# EAGLE design thermometer (EAGLE 9.6.0)
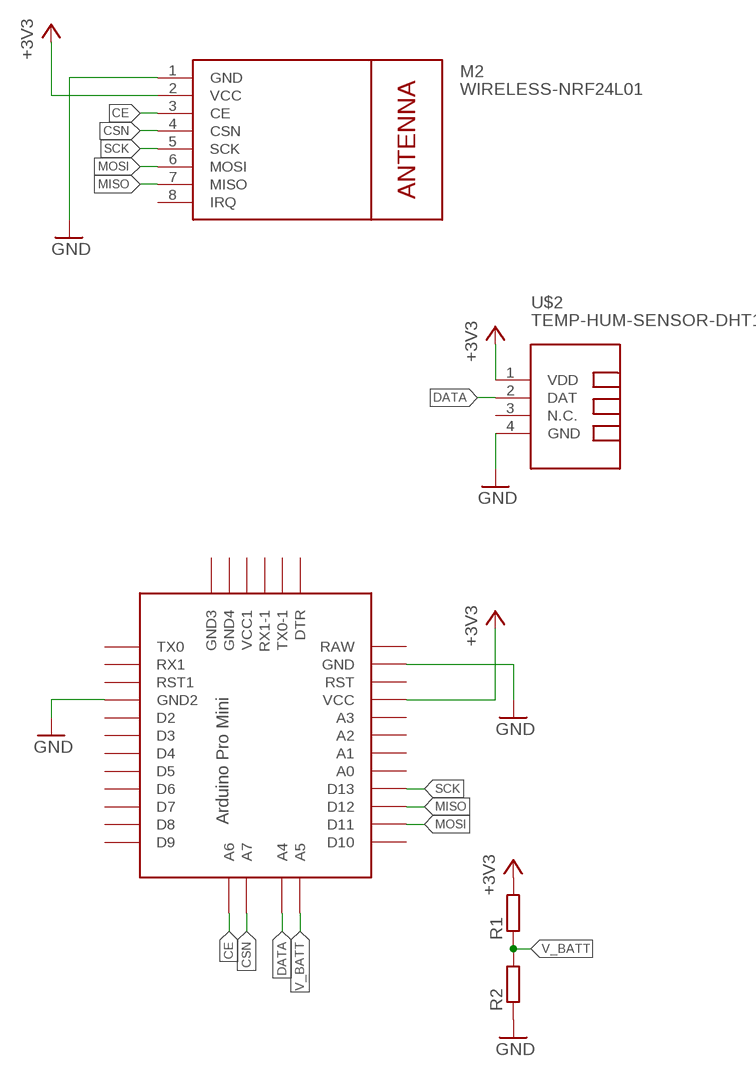
[diagram p0: schematic, sheet 1]

## Parts
M2  WIRELESS-NRF24L01  [WIRELESS-NRF24L01]
R1  R-EU_R0805  [R0805]
R2  R-EU_R0805  [R0805]
U$2  TEMP-HUM-SENSOR-DHT11  [TEMP-HUM-SENSOR-DHT11]
U$3  PRO-MINI-2  [PRO-MINI-2]

## Nets
+3V3: M2.2(VCC) R1.2 U$2.1(VDD) U$3.VCC
CE: M2.3(CE) U$3.A6
CSN: M2.4(CSN) U$3.A7
DATA: U$2.2(DAT) U$3.A4
GND: M2.1(GND) R2.1 U$2.4(GND) U$3.GND U$3.GND1(GND2)
MISO: M2.7(MISO) U$3.D12
MOSI: M2.6(MOSI) U$3.D11
SCK: M2.5(SCK) U$3.D13
V_BATT: R1.1 R2.2 U$3.A5
Unconnected: M2.8(IRQ) U$2.3(N.C.) U$3.A0 U$3.A1 U$3.A2 U$3.A3 U$3.D2 U$3.D3 U$3.D4 U$3.D5 U$3.D6 U$3.D7 U$3.D8 U$3.D9 U$3.D10 U$3.DTR U$3.GND2(GND3) U$3.GND3(GND4) U$3.RAW U$3.RST U$3.RST1 U$3.RX1 U$3.RX1-1 U$3.TX0 U$3.TX0-1 U$3.VCC1

## Library data of the parts
M2 = diy-modules:WIRELESS-NRF24L01: 2.4 GHz Wireless Module based on NRF24L01 chip More details available here: http://www.electrodragon.com/w/NRF24L01 Click here to find device on ebay.com <http://www.ebay.com/sch/nrf24l01+arduino>
R1 R2 = rcl:R-EU_: RESISTOR, European symbol; SPICEPREFIX: R
U$2 = diy-modules:TEMP-HUM-SENSOR-DHT11: DHT11 - digital humidity & temperature sensor DHT11 datasheet available here: https://akizukidenshi.com/download/ds/aosong/DHT11.pdf Click here to find device on ebay.com <http://www.ebay.com/sch/dht11+digital+sensor>
U$3 = Arduino-clone:PRO-MINI-2: Arduino Pro Mini Layout 2 Sparkfun.com

## Board
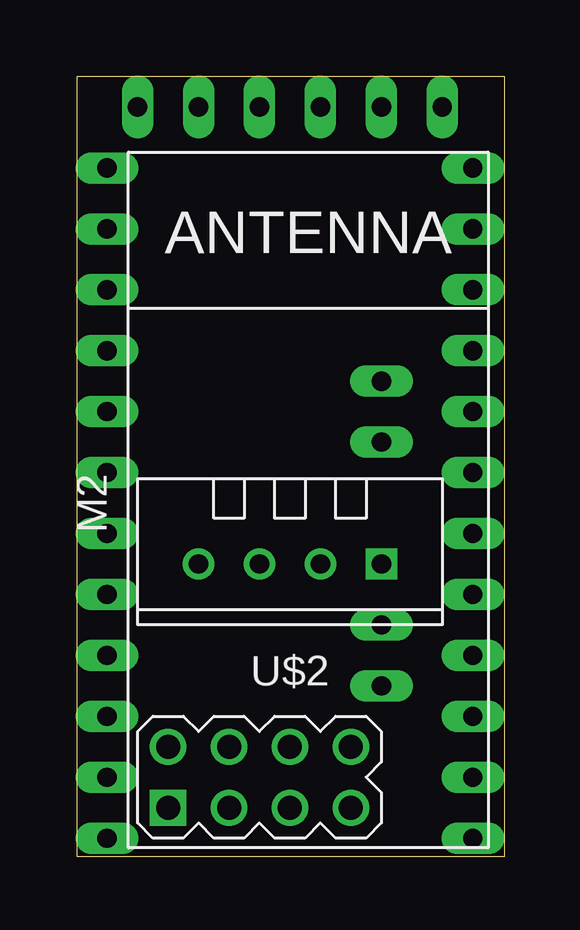
[diagram p1: board, top side]
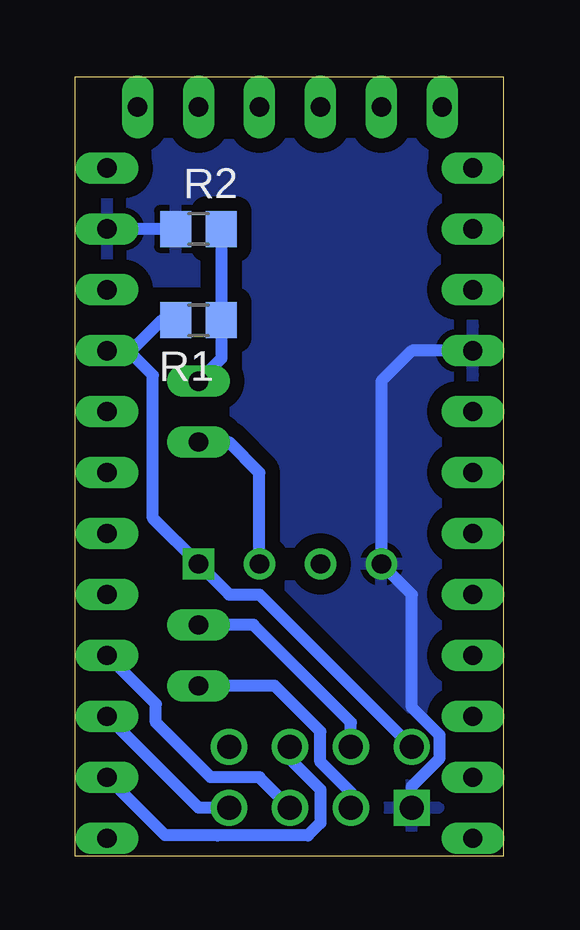
[diagram p2: board, bottom side, seen from below]

Size 17.83 x 32.5 mm. Coordinates in mm from the lower left corner, seen from the top.
Outline: 0,0 17.83,0 17.83,32.5 0,32.5 0,0
Copper layers (1*16): Top 0.035mm / dielectric 1.5mm / Bottom 0.035mm
Design rules "default": minimum track width 6mil, minimum drill 0.35mm, track to track 6mil, track to pad 6mil, pad to pad 6mil, via to via 6mil, smd to smd 6mil, copper to edge 40mil, drill to drill 6mil, minimum pad ring 10mil, minimum via ring 8mil, stop-mask expansion 4mil, vias tented up to drill 0mil, thermal gap 10mil

### Footprints (pad centres in the part's own frame; a part is rotated, then mirrored left to right if it is on the bottom)
WIRELESS-NRF24L01 = drill 1 square: 1 -12.7,6.35 | drill 1: 2 -10.16,6.35; 3 -12.7,3.81; 4 -10.16,3.81; 5 -12.7,1.27; 6 -10.16,1.27; 7 -12.7,-1.27; 8 -10.16,-1.27
R0805 = smd 1.3 x 1.5: 1 -0.95,0; 2 0.95,0
TEMP-HUM-SENSOR-DHT11 = drill 0.8 square: 1 -3.81,0 | drill 0.8: 2 -1.27,0; 3 1.27,0; 4 3.81,0
PRO-MINI-2 = drill 0.8 long: A0 6.35,2.54; A1 6.35,0; A2 6.35,-2.54; A3 6.35,-5.08; A4 2.54,1.27; A5 2.54,3.81; A6 2.54,-8.89; A7 2.54,-6.35; D2 -8.89,2.54; D3 -8.89,0; D4 -8.89,-2.54; D5 -8.89,-5.08; D6 -8.89,-7.62; D7 -8.89,-10.16; D8 -8.89,-12.7; D9 -8.89,-15.24; D10 6.35,-15.24; D11 6.35,-12.7; D12 6.35,-10.16; D13 6.35,-7.62; DTR 5.08,15.24; GND 6.35,10.16; GND1 -8.89,5.08; GND2 -7.62,15.24; GND3 -5.08,15.24; RAW 6.35,12.7; RST 6.35,7.62; RST1 -8.89,7.62; RX1 -8.89,10.16; RX1-1 0,15.24; TX0 -8.89,12.7; TX0-1 2.54,15.24; VCC 6.35,5.08; VCC1 -2.54,15.24

### Placement (x,y rotation side)
M2  10.16,14.73 90 top
R1  12.7,22.35 180 bottom
R2  12.7,26.16 0 bottom
U$2  8.89,12.19 180 top
U$3  10.16,16 0 top

### Tracks (layer width: path | path; a pad name or v marks a point on that pad's centre or on a via)
+3V3
  Bottom 0.508: M2.2 10.16,10.92 11.43,10.92 U$2.1 14.61,14.1 14.61,20.07 15.62,21.08 U$3.VCC 15.49,21.08 14.22,22.35 R1.2
CE
  Bottom 0.508: M2.3 6.35,2.67 7.62,3.94 7.62,5.21 9.53,7.11 U$3.A6
CSN
  Bottom 0.508: M2.4 6.35,5.59 10.41,9.65 U$3.A7
DATA
  Bottom 0.508: U$2.2 10.16,16 11.43,17.27 U$3.A4
GND
  Bottom 0.508: R2.1 U$3.GND | M2.1 3.81,2.93 2.65,4.09 2.65,5.05 3.81,6.21 3.81,10.92 U$2.4 5.08,19.81 3.81,21.08 U$3.GND1
  pour Bottom (isolate 0.61): -2.54,33.78 -2.54,-3.05 20.32,-3.05 20.32,33.78
MISO
  Bottom 0.508: M2.7 12.7,2.03 U$3.D12
MOSI
  Bottom 0.508: M2.6 8.89,4.06 7.62,2.79 7.62,1.4 8.15,0.87 11.91,0.87 11.93,0.89 14.1,0.89 U$3.D11
SCK
  Bottom 0.508: M2.5 10.16,3.3 12.19,3.3 14.48,5.59 14.48,6.35 U$3.D13
V_BATT
  Bottom 0.508: R2.2 R1.1 11.75,20.76 U$3.A5